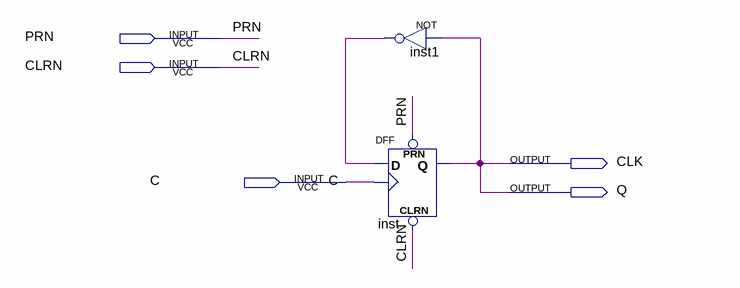
[diagram p0: schematic sheet]
// Quartus schematic clk.bdf as structural Verilog: 2 symbols, 5 pins
module clk (
  input  PRN,
  input  CLRN,
  input  C,
  output CLK,
  output Q
);

  wire inst1_out;

  not inst1 (inst1_out, CLK);
  DFF inst (.CLRN(CLRN), .CLK(C), .D(inst1_out), .PRN(PRN), .Q(CLK));

  assign Q = CLK;
endmodule
